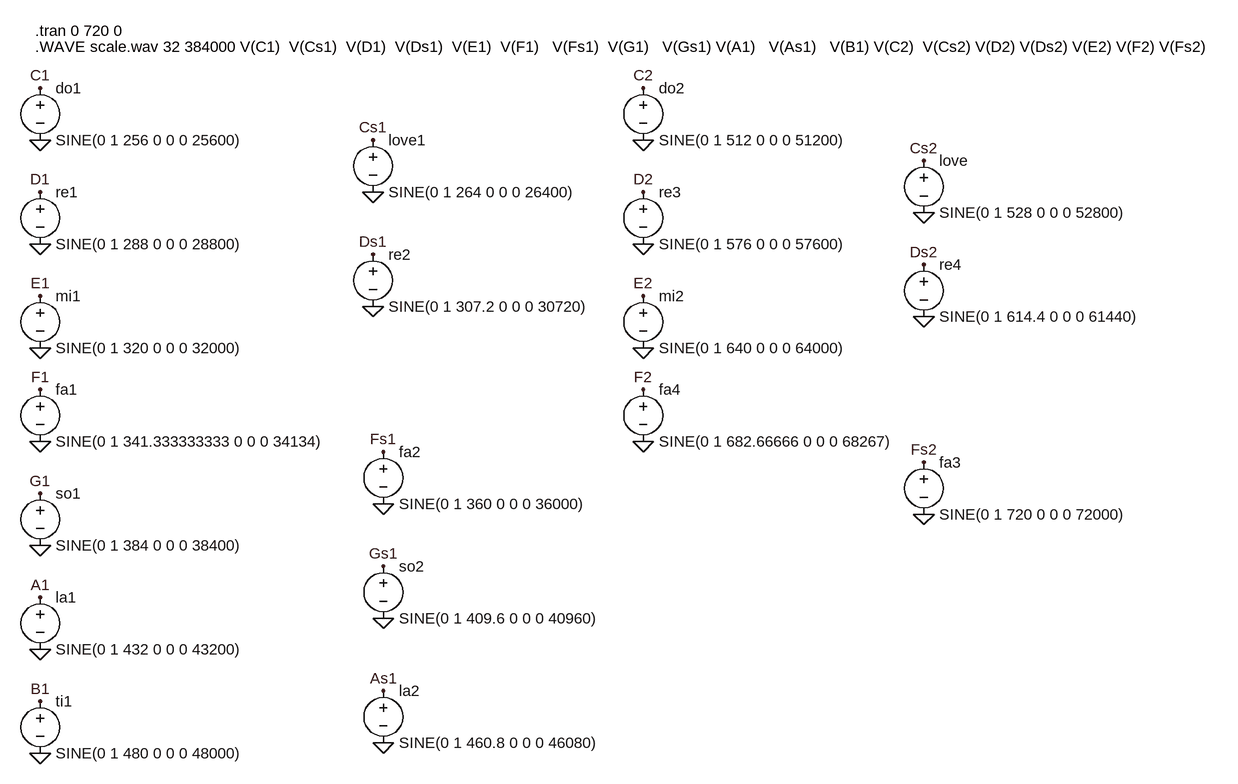
[diagram p0: schematic chords.asc]
chords.asc, the LTspice schematic file:
Version 4
SHEET 1 1512 900
FLAG -512 -400 0
FLAG -512 -480 C1
FLAG -512 -320 D1
FLAG -512 -80 0
FLAG -512 -160 E1
FLAG -512 -16 F1
FLAG -512 224 0
FLAG -512 144 G1
FLAG -512 304 A1
FLAG -512 544 0
FLAG -512 464 B1
FLAG -512 -240 0
FLAG -512 64 0
FLAG -512 384 0
FLAG 848 -288 0
FLAG 848 -368 Cs2
FLAG 0 -224 Ds1
FLAG 0 -144 0
FLAG 16 80 Fs1
FLAG 16 160 0
FLAG 16 336 0
FLAG 16 256 Gs1
FLAG 16 448 As1
FLAG 16 528 0
FLAG 0 -320 0
FLAG 0 -400 Cs1
FLAG 848 96 Fs2
FLAG 848 176 0
FLAG 416 -400 0
FLAG 416 -480 C2
FLAG 416 -320 D2
FLAG 416 -80 0
FLAG 416 -160 E2
FLAG 416 -16 F2
FLAG 416 -240 0
FLAG 416 64 0
FLAG 848 -208 Ds2
FLAG 848 -128 0
SYMBOL voltage -512 -496 R0
WINDOW 123 0 0 Left 0
WINDOW 39 0 0 Left 0
SYMATTR InstName do1
SYMATTR Value SINE(0 1 256 0 0 0 25600)
SYMBOL voltage -512 -336 R0
WINDOW 123 0 0 Left 0
WINDOW 39 0 0 Left 0
SYMATTR InstName re1
SYMATTR Value SINE(0 1 288 0 0 0 28800)
SYMBOL voltage -512 -176 R0
WINDOW 123 0 0 Left 0
WINDOW 39 0 0 Left 0
SYMATTR InstName mi1
SYMATTR Value SINE(0 1 320 0 0 0 32000)
SYMBOL voltage -512 -32 R0
WINDOW 123 0 0 Left 0
WINDOW 39 0 0 Left 0
SYMATTR InstName fa1
SYMATTR Value SINE(0 1 341.333333333 0 0 0 34134)
SYMBOL voltage -512 128 R0
WINDOW 123 0 0 Left 0
WINDOW 39 0 0 Left 0
SYMATTR InstName so1
SYMATTR Value SINE(0 1 384 0 0 0 38400)
SYMBOL voltage -512 288 R0
WINDOW 123 0 0 Left 0
WINDOW 39 0 0 Left 0
SYMATTR InstName la1
SYMATTR Value SINE(0 1 432 0 0 0 43200)
SYMBOL voltage -512 448 R0
WINDOW 123 0 0 Left 0
WINDOW 39 0 0 Left 0
SYMATTR InstName ti1
SYMATTR Value SINE(0 1 480 0 0 0 48000)
SYMBOL voltage 848 -384 R0
WINDOW 123 0 0 Left 0
WINDOW 39 0 0 Left 0
SYMATTR InstName love
SYMATTR Value SINE(0 1 528 0 0 0 52800)
SYMBOL voltage 0 -240 R0
WINDOW 123 0 0 Left 0
WINDOW 39 0 0 Left 0
SYMATTR InstName re2
SYMATTR Value SINE(0 1 307.2 0 0 0 30720)
SYMBOL voltage 16 64 R0
WINDOW 123 0 0 Left 0
WINDOW 39 0 0 Left 0
SYMATTR InstName fa2
SYMATTR Value SINE(0 1 360 0 0 0 36000)
SYMBOL voltage 16 240 R0
WINDOW 123 0 0 Left 0
WINDOW 39 0 0 Left 0
SYMATTR InstName so2
SYMATTR Value SINE(0 1 409.6 0 0 0 40960)
SYMBOL voltage 16 432 R0
WINDOW 123 0 0 Left 0
WINDOW 39 0 0 Left 0
SYMATTR InstName la2
SYMATTR Value SINE(0 1 460.8 0 0 0 46080)
SYMBOL voltage 0 -416 R0
WINDOW 123 0 0 Left 0
WINDOW 39 0 0 Left 0
SYMATTR InstName love1
SYMATTR Value SINE(0 1 264 0 0 0 26400)
SYMBOL voltage 848 80 R0
WINDOW 123 0 0 Left 0
WINDOW 39 0 0 Left 0
SYMATTR InstName fa3
SYMATTR Value SINE(0 1 720 0 0 0 72000)
SYMBOL voltage 416 -496 R0
WINDOW 123 0 0 Left 0
WINDOW 39 0 0 Left 0
SYMATTR InstName do2
SYMATTR Value SINE(0 1 512 0 0 0 51200)
SYMBOL voltage 416 -336 R0
WINDOW 123 0 0 Left 0
WINDOW 39 0 0 Left 0
SYMATTR InstName re3
SYMATTR Value SINE(0 1 576 0 0 0 57600)
SYMBOL voltage 416 -176 R0
WINDOW 123 0 0 Left 0
WINDOW 39 0 0 Left 0
SYMATTR InstName mi2
SYMATTR Value SINE(0 1 640 0 0 0 64000)
SYMBOL voltage 416 -32 R0
WINDOW 123 0 0 Left 0
WINDOW 39 0 0 Left 0
SYMATTR InstName fa4
SYMATTR Value SINE(0 1 682.66666 0 0 0 68267)
SYMBOL voltage 848 -224 R0
WINDOW 123 0 0 Left 0
WINDOW 39 0 0 Left 0
SYMATTR InstName re4
SYMATTR Value SINE(0 1 614.4 0 0 0 61440)
TEXT -520 -568 Left 2 !.tran 0 720 0
TEXT -520 -544 Left 2 !.WAVE scale.wav 32 384000 V(C1)  V(Cs1)  V(D1)  V(Ds1)  V(E1)  V(F1)   V(Fs1)  V(G1)   V(Gs1) V(A1)   V(As1)   V(B1) V(C2)  V(Cs2) V(D2) V(Ds2) V(E2) V(F2) V(Fs2)

The netlist it stands for:
* chords.asc
V§do1 C1 0 SINE(0 1 256 0 0 0 25600)
V§re1 D1 0 SINE(0 1 288 0 0 0 28800)
V§mi1 E1 0 SINE(0 1 320 0 0 0 32000)
V§fa1 F1 0 SINE(0 1 341.333333333 0 0 0 34134)
V§so1 G1 0 SINE(0 1 384 0 0 0 38400)
V§la1 A1 0 SINE(0 1 432 0 0 0 43200)
V§ti1 B1 0 SINE(0 1 480 0 0 0 48000)
V§love Cs2 0 SINE(0 1 528 0 0 0 52800)
V§re2 Ds1 0 SINE(0 1 307.2 0 0 0 30720)
V§fa2 Fs1 0 SINE(0 1 360 0 0 0 36000)
V§so2 Gs1 0 SINE(0 1 409.6 0 0 0 40960)
V§la2 As1 0 SINE(0 1 460.8 0 0 0 46080)
V§love1 Cs1 0 SINE(0 1 264 0 0 0 26400)
V§fa3 Fs2 0 SINE(0 1 720 0 0 0 72000)
V§do2 C2 0 SINE(0 1 512 0 0 0 51200)
V§re3 D2 0 SINE(0 1 576 0 0 0 57600)
V§mi2 E2 0 SINE(0 1 640 0 0 0 64000)
V§fa4 F2 0 SINE(0 1 682.66666 0 0 0 68267)
V§re4 Ds2 0 SINE(0 1 614.4 0 0 0 61440)
.tran 0 720 0
.WAVE scale.wav 32 384000 V(C1)  V(Cs1)  V(D1)  V(Ds1)  V(E1)  V(F1)   V(Fs1)  V(G1)   V(Gs1) V(A1)   V(As1)   V(B1) V(C2)  V(Cs2) V(D2) V(Ds2) V(E2) V(F2) V(Fs2)
.backanno
.end